# Altium schematic sheet 1_MCU & Flash.schdoc
size 497 x 241 mm; Name: A_Customize; Symbol: A_A4; Device: A_Customize; @Project Name: Arduboy V5.0_2022-07-06_10-02-52; REV: 5.0; Date: 2022-04-23; Sheet: 1 /3; Draw By: LiLinBai; Company: FastLab Team; Convert to PCB: yes; Add into BOM: yes
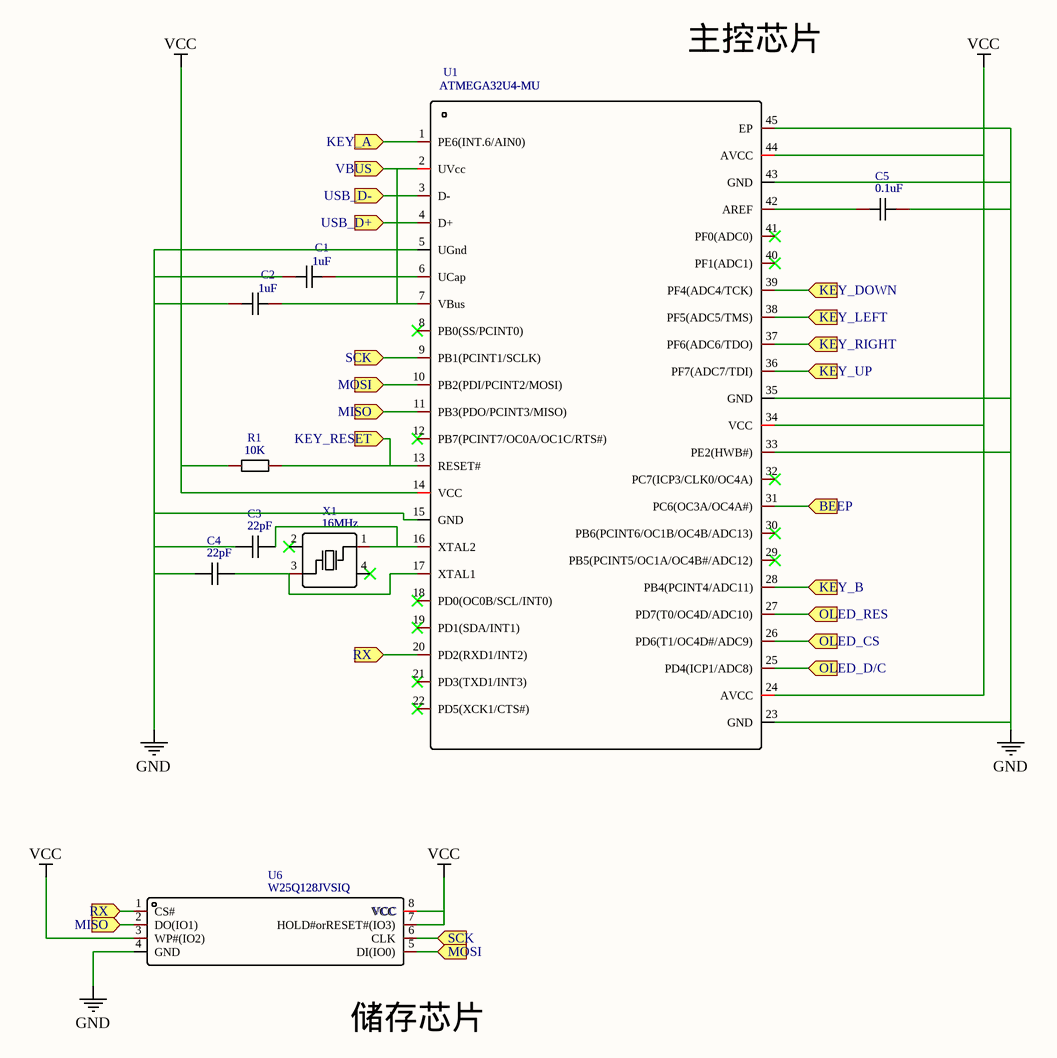
[diagram p0: 1_MCU & Flash.schdoc]

## Parts
C1  1uF  [C0603]
C2  1uF  [C0603]
C3  22pF  [C0603]
C4  22pF  [C0603]
C5  0.1uF  [C0603]
R1  10K  [R0603]
U1  ATMEGA32U4-MU  [VQFN-44_L7.0-W7.0-P0.50-BL-EP5.2]
U6  W25Q128JVSIQ  NAME: VCC  [SOIC-8_L5.3-W5.3-P1.27-LS8.0-BL]
X1  16MHz  [OSC-SMD_4P-L3.2-W2.5-BL]

## Ports
BEEP (in), KEY_A (in), KEY_B (in), KEY_DOWN (in), KEY_LEFT (in), KEY_RESET (in), KEY_RIGHT (in), KEY_UP (in), MISO (in), MOSI (in), OLED_CS (in), OLED_D/C (in), OLED_RES (in), RX (in), SCK (in), USB_D+ (in), USB_D- (in), VBUS (in)

## Nets
GND: C1.1 C2.1 C3.1 C4.1 C5.2 U1.5(UGnd) U1.15(GND) U1.23(GND) U1.33(PE2(HWB#)) U1.35(GND) U1.43(GND) U1.45(EP) U6.4(GND)
VCC: R1.1 U1.14(VCC) U1.24(AVCC) U1.34(VCC) U1.44(AVCC) U6.3(WP#(IO2)) U6.7(HOLD#orRESET#(IO3)) U6.8(VCC)
BEEP: U1.31(PC6(OC3A/OC4A#)) ; port BEEP
KEY_A: U1.1(PE6(INT.6/AIN0)) ; port KEY_A
KEY_B: U1.28(PB4(PCINT4/ADC11)) ; port KEY_B
KEY_DOWN: U1.39(PF4(ADC4/TCK)) ; port KEY_DOWN
KEY_LEFT: U1.38(PF5(ADC5/TMS)) ; port KEY_LEFT
KEY_RESET: R1.2 U1.13(RESET#) ; port KEY_RESET
KEY_RIGHT: U1.37(PF6(ADC6/TDO)) ; port KEY_RIGHT
KEY_UP: U1.36(PF7(ADC7/TDI)) ; port KEY_UP
MISO: U1.11(PB3(PDO/PCINT3/MISO)) U6.2(DO(IO1)) ; port MISO
MOSI: U1.10(PB2(PDI/PCINT2/MOSI)) U6.5(DI(IO0)) ; port MOSI
OLED_CS: U1.26(PD6(T1/OC4D#/ADC9)) ; port OLED_CS
OLED_D/C: U1.25(PD4(ICP1/ADC8)) ; port OLED_D/C
OLED_RES: U1.27(PD7(T0/OC4D/ADC10)) ; port OLED_RES
RX: U1.20(PD2(RXD1/INT2)) U6.1(CS#) ; port RX
SCK: U1.9(PB1(PCINT1/SCLK)) U6.6(CLK) ; port SCK
USB_D+: U1.4(D+) ; port USB_D+
USB_D-: U1.3(D-) ; port USB_D-
VBUS: C2.2 U1.2(UVcc) U1.7(VBus) ; port VBUS
NetC1_2: C1.2 U1.6(UCap)
NetC3_2: C3.2 U1.16(XTAL2) X1.1(OSC1)
NetC4_2: C4.2 U1.17(XTAL1) X1.3(OSC2)
NetC5_1: C5.1 U1.42(AREF)

Not connected (* = marked no-connect by the designer): U1 8(PB0(SS/PCINT0))* 12(PB7(PCINT7/OC0A/OC1C/RTS#))* 18(PD0(OC0B/SCL/INT0))* 19(PD1(SDA/INT1))* 21(PD3(TXD1/INT3))* 22(PD5(XCK1/CTS#))* 29(PB5(PCINT5/OC1A/OC4B#/ADC12))* 30(PB6(PCINT6/OC1B/OC4B/ADC13))* 32(PC7(ICP3/CLK0/OC4A))* 40(PF1(ADC1))* 41(PF0(ADC0))*; X1 2(GND)* 4(GND)*

## Notes on the sheet
- 主控芯片
- (near U6) 储存芯片
- 1
- 2
- 3
- 4
- 5
- A
- B
- C
- D
- TITLE:
- REV:
- Arduboy V5.0_2022-07-06_10-02-52
- Date:
- Company:
- FastLab Team
- Drawn By:
- Sheet:
- 5.0
- 1 /3
- 2022-04-23
- LiLinBai

## Library data of the parts
C1 C2 = GRM188R61C105KA93D: Manufacturer: MuRata; Convert to PCB: yes; Name: 1uF; Symbol: 1uF; Device: GRM188R61C105KA93D; Supplier: LCSC; Manufacturer Part: GRM188R61C105KA93D; Supplier Part: C77404; JLCPCB Part Class: Extended Part; Add into BOM: yes; Origin Footprint: C0603
C3 C4 = 0603CG220J201NT: Manufacturer: FH; Convert to PCB: yes; Name: 22pF; Symbol: 22pF; Device: 0603CG220J201NT; Supplier: LCSC; Manufacturer Part: 0603CG220J201NT; Supplier Part: C63681; JLCPCB Part Class: Extended Part; Add into BOM: yes; Origin Footprint: C0603
C5 = 0603BB104K500NGT: Manufacturer: Knowles(楼氏); Convert to PCB: yes; Name: 0.1uF; Symbol: 0.1uF; Device: 0603BB104K500NGT; Supplier: LCSC; Supplier Part: C2168571; Manufacturer Part: 0603BB104K500NGT; JLCPCB Part Class: Extended Part; Add into BOM: yes; Origin Footprint: C0603
R1 = RT0603FRD0710KL: Manufacturer: YAGEO; Resistance: 10kΩ; Convert to PCB: yes; Name: 10K; Symbol: 10K; Device: RT0603FRD0710KL; Supplier: LCSC; Supplier Part: C160601; Manufacturer Part: RT0603FRD0710KL; JLCPCB Part Class: Extended Part; Add into BOM: yes; Origin Footprint: R0603
U1 = ATMEGA32U4-MU: Manufacturer: MICROCHIP; Convert to PCB: yes; Name: ATMEGA32U4-MU; Symbol: ATMEGA32U4-MU; Device: ATMEGA32U4-MU; Supplier: LCSC; Manufacturer Part: ATMEGA32U4-MU; Supplier Part: C112161; JLCPCB Part Class: Extended Part; Add into BOM: yes; Origin Footprint: VQFN-44_L7.0-W7.0-P0.50-BL-EP5.2
U6 = W25Q128JVSIQ: Manufacturer: Winbond Elec; Convert to PCB: yes; Name: W25Q128JVSIQ; Symbol: W25Q128JVSIQ; Device: W25Q128JVSIQ; Supplier: LCSC; Supplier Part: C113767; Manufacturer Part: W25Q128JVSIQ; JLCPCB Part Class: Extended Part; Add into BOM: yes; Origin Footprint: SOIC-8_L5.3-W5.3-P1.27-LS8.0-BL
X1 = X1E000021011900: Manufacturer: EPSON; Convert to PCB: yes; Name: 16MHz; Symbol: 16MHz; Device: X1E000021011900; Supplier: LCSC; Manufacturer Part: X1E000021011900; Supplier Part: C89371; JLCPCB Part Class: Extended Part; Add into BOM: yes; Origin Footprint: OSC-SMD_4P-L3.2-W2.5-BL